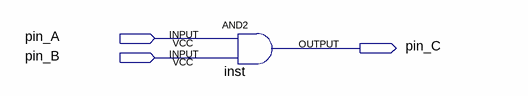
[diagram p0: schematic sheet]
// Quartus schematic test01.bdf as structural Verilog: 1 symbols, 3 pins
module test01 (
  input  pin_A,
  input  pin_B,
  output pin_C
);

  and inst (pin_C, pin_A, pin_B);
endmodule
